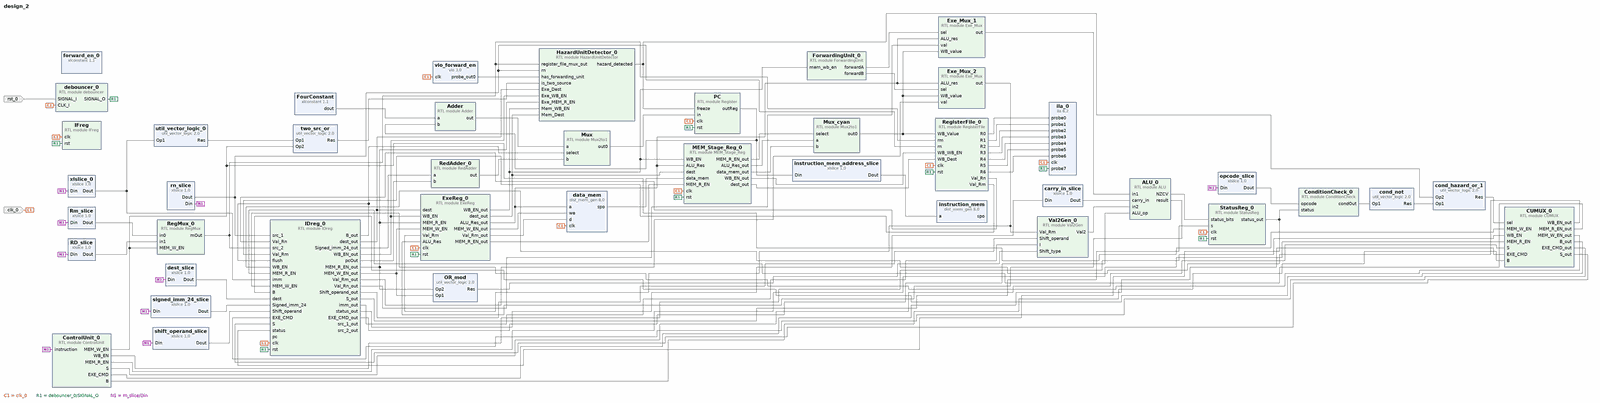
[diagram p0: block diagram of the top level, whole]
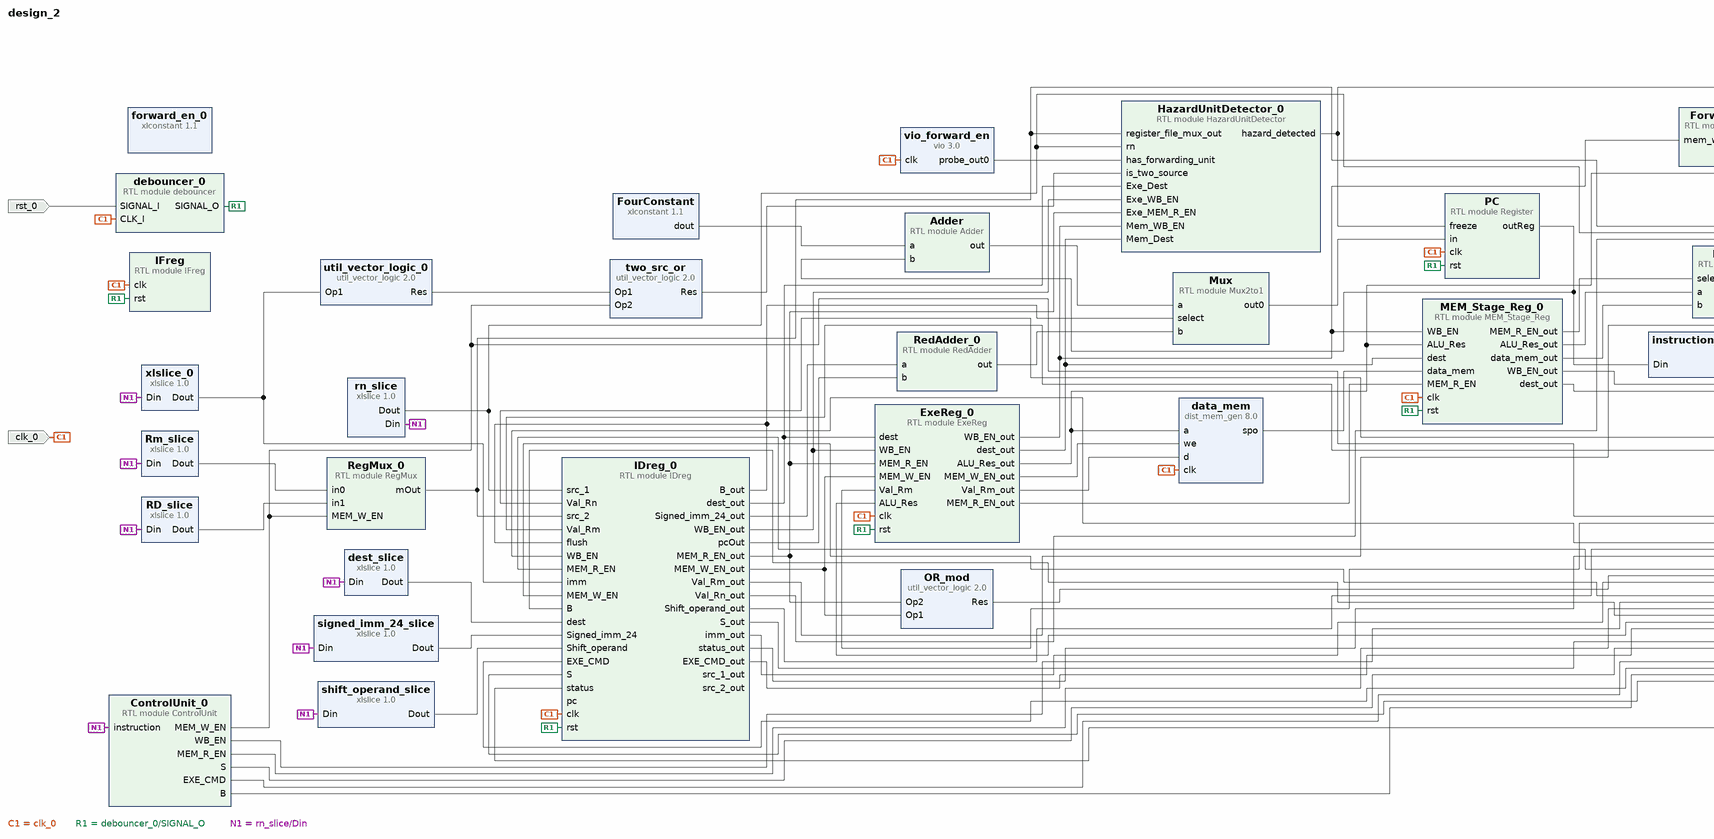
[diagram p1: block diagram of the top level, left part]
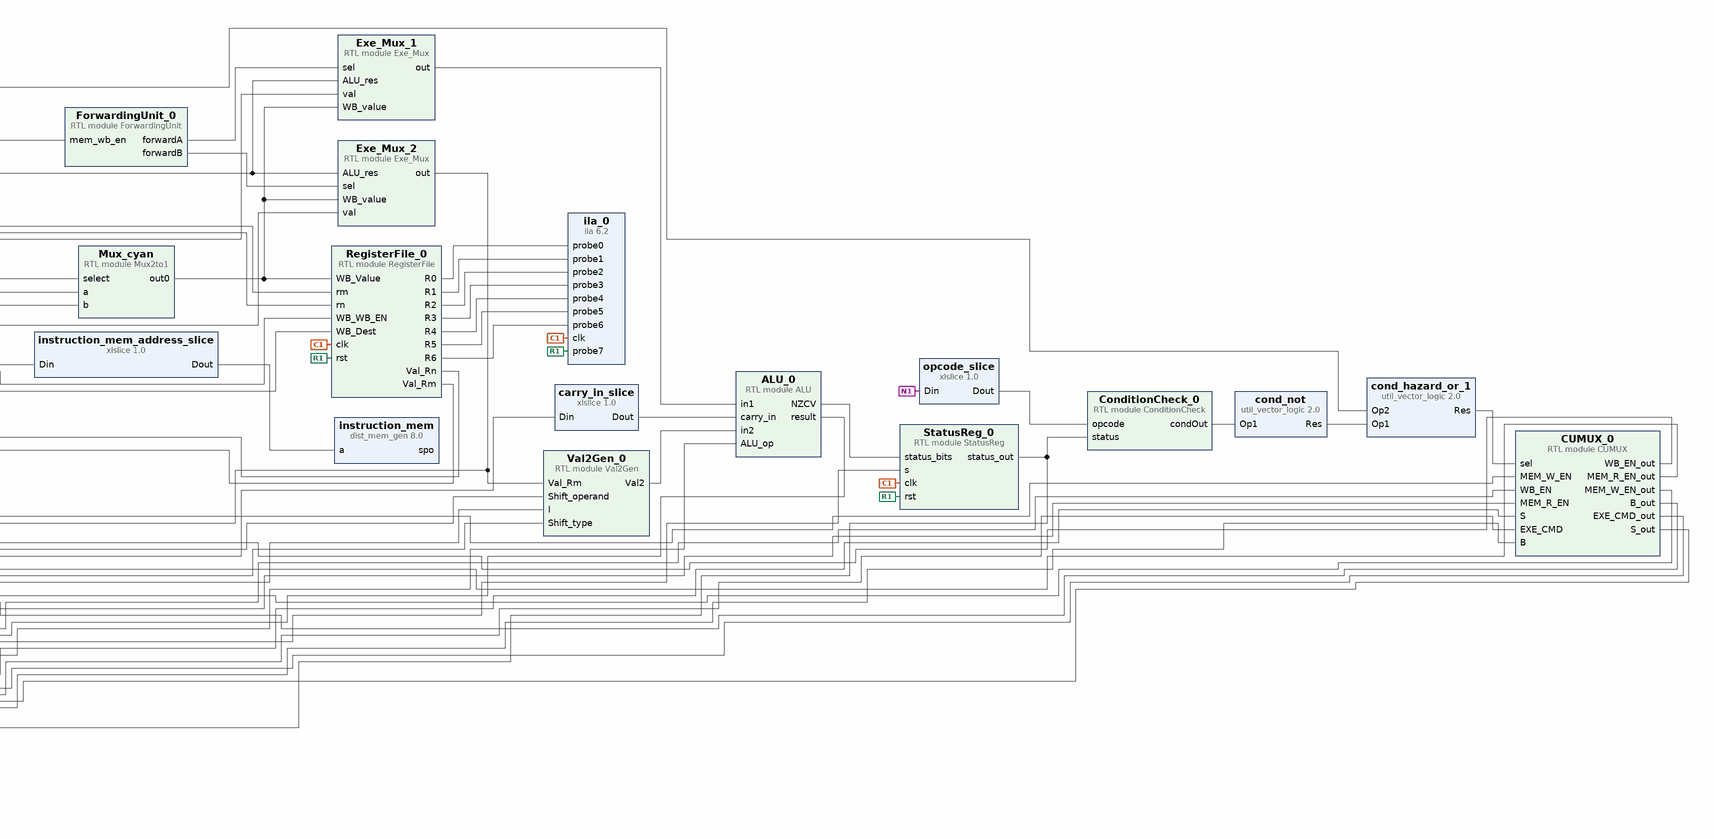
[diagram p2: block diagram of the top level, right part]
# Vivado block design design_2, xc7z010clg400-1, Vivado 2018.3
create_bd_design design_2

create_bd_port -dir I -type clk clk_0
create_bd_port -dir I -type rst rst_0

create_bd_cell -type ip -vlnv xilinx.com:ip:xlconstant:1.1 FourConstant
set_property -dict {CONFIG.CONST_VAL 1 CONFIG.CONST_WIDTH 32} [get_bd_cells FourConstant]
create_bd_cell -type module -reference Mux2to1 Mux
create_bd_cell -type module -reference Register PC
create_bd_cell -type module -reference debouncer debouncer_0
create_bd_cell -type ip -vlnv xilinx.com:ip:ila:6.2 ila_0
set_property -dict [list \
  CONFIG.C_ENABLE_ILA_AXI_MON false \
  CONFIG.C_MONITOR_TYPE Native \
  CONFIG.C_NUM_OF_PROBES 8 \
  CONFIG.C_PROBE0_TYPE 1 \
  CONFIG.C_PROBE0_WIDTH 32 \
  CONFIG.C_PROBE1_TYPE 1 \
  CONFIG.C_PROBE1_WIDTH 32 \
  CONFIG.C_PROBE2_TYPE 1 \
  CONFIG.C_PROBE2_WIDTH 32 \
  CONFIG.C_PROBE3_TYPE 1 \
  CONFIG.C_PROBE3_WIDTH 32 \
  CONFIG.C_PROBE4_TYPE 1 \
  CONFIG.C_PROBE4_WIDTH 32 \
  CONFIG.C_PROBE5_TYPE 1 \
  CONFIG.C_PROBE5_WIDTH 32 \
  CONFIG.C_PROBE6_TYPE 1 \
  CONFIG.C_PROBE6_WIDTH 32 \
  CONFIG.C_PROBE7_TYPE 2 \
  CONFIG.C_PROBE7_WIDTH 1 \
] [get_bd_cells ila_0]
create_bd_cell -type ip -vlnv xilinx.com:ip:xlslice:1.0 instruction_mem_address_slice
set_property -dict {CONFIG.DIN_FROM 12 CONFIG.DOUT_WIDTH 13} [get_bd_cells instruction_mem_address_slice]
create_bd_cell -type module -reference RegMux RegMux_0
create_bd_cell -type ip -vlnv xilinx.com:ip:xlslice:1.0 rn_slice
set_property -dict {CONFIG.DIN_FROM 19 CONFIG.DIN_TO 16 CONFIG.DOUT_WIDTH 4} [get_bd_cells rn_slice]
create_bd_cell -type ip -vlnv xilinx.com:ip:xlslice:1.0 RD_slice
set_property -dict {CONFIG.DIN_FROM 15 CONFIG.DIN_TO 12 CONFIG.DOUT_WIDTH 4} [get_bd_cells RD_slice]
create_bd_cell -type ip -vlnv xilinx.com:ip:xlslice:1.0 Rm_slice
set_property -dict {CONFIG.DIN_FROM 3 CONFIG.DOUT_WIDTH 4} [get_bd_cells Rm_slice]
create_bd_cell -type ip -vlnv xilinx.com:ip:xlslice:1.0 opcode_slice
set_property -dict {CONFIG.DIN_FROM 31 CONFIG.DIN_TO 28 CONFIG.DOUT_WIDTH 4} [get_bd_cells opcode_slice]
create_bd_cell -type ip -vlnv xilinx.com:ip:util_vector_logic:2.0 cond_not
set_property -dict {CONFIG.C_OPERATION not CONFIG.C_SIZE 1} [get_bd_cells cond_not]
create_bd_cell -type ip -vlnv xilinx.com:ip:util_vector_logic:2.0 cond_hazard_or_1
set_property -dict {CONFIG.C_OPERATION or CONFIG.C_SIZE 1} [get_bd_cells cond_hazard_or_1]
create_bd_cell -type ip -vlnv xilinx.com:ip:xlslice:1.0 dest_slice
set_property -dict {CONFIG.DIN_FROM 15 CONFIG.DIN_TO 12 CONFIG.DOUT_WIDTH 4} [get_bd_cells dest_slice]
create_bd_cell -type ip -vlnv xilinx.com:ip:xlslice:1.0 signed_imm_24_slice
set_property -dict {CONFIG.DIN_FROM 23 CONFIG.DIN_TO 0 CONFIG.DOUT_WIDTH 24} [get_bd_cells signed_imm_24_slice]
create_bd_cell -type ip -vlnv xilinx.com:ip:xlslice:1.0 shift_operand_slice
set_property -dict {CONFIG.DIN_FROM 11 CONFIG.DOUT_WIDTH 12} [get_bd_cells shift_operand_slice]
create_bd_cell -type ip -vlnv xilinx.com:ip:dist_mem_gen:8.0 instruction_mem
set_property -dict [list \
  CONFIG.coefficient_file output.coe \
  CONFIG.data_width 32 \
  CONFIG.depth 8192 \
  CONFIG.memory_type rom \
] [get_bd_cells instruction_mem]
create_bd_cell -type ip -vlnv xilinx.com:ip:dist_mem_gen:8.0 data_mem
set_property -dict {CONFIG.data_width 32 CONFIG.depth 8192} [get_bd_cells data_mem]
create_bd_cell -type ip -vlnv xilinx.com:ip:util_vector_logic:2.0 OR_mod
set_property -dict {CONFIG.C_OPERATION or} [get_bd_cells OR_mod]
create_bd_cell -type ip -vlnv xilinx.com:ip:xlslice:1.0 carry_in_slice
set_property -dict {CONFIG.DIN_FROM 1 CONFIG.DIN_TO 1 CONFIG.DIN_WIDTH 4 CONFIG.DOUT_WIDTH 1} [get_bd_cells carry_in_slice]
create_bd_cell -type module -reference ExeReg ExeReg_0
create_bd_cell -type module -reference Mux2to1 Mux_cyan
create_bd_cell -type module -reference MEM_Stage_Reg MEM_Stage_Reg_0
create_bd_cell -type module -reference Val2Gen Val2Gen_0
create_bd_cell -type ip -vlnv xilinx.com:ip:util_vector_logic:2.0 two_src_or
set_property -dict {CONFIG.C_OPERATION or CONFIG.C_SIZE 1} [get_bd_cells two_src_or]
create_bd_cell -type ip -vlnv xilinx.com:ip:util_vector_logic:2.0 util_vector_logic_0
set_property -dict {CONFIG.C_OPERATION not CONFIG.C_SIZE 1} [get_bd_cells util_vector_logic_0]
create_bd_cell -type module -reference CUMUX CUMUX_0
create_bd_cell -type module -reference ConditionCheck ConditionCheck_0
create_bd_cell -type module -reference StatusReg StatusReg_0
create_bd_cell -type module -reference Adder Adder
create_bd_cell -type module -reference RedAdder RedAdder_0
create_bd_cell -type ip -vlnv xilinx.com:ip:xlslice:1.0 xlslice_0
set_property -dict {CONFIG.DIN_FROM 25 CONFIG.DIN_TO 25} [get_bd_cells xlslice_0]
create_bd_cell -type module -reference IDreg IDreg_0
create_bd_cell -type module -reference Exe_Mux Exe_Mux_1
create_bd_cell -type module -reference Exe_Mux Exe_Mux_2
create_bd_cell -type module -reference RegisterFile RegisterFile_0
create_bd_cell -type ip -vlnv xilinx.com:ip:vio:3.0 vio_forward_en
set_property -dict {CONFIG.C_NUM_PROBE_IN 0} [get_bd_cells vio_forward_en]
create_bd_cell -type ip -vlnv xilinx.com:ip:xlconstant:1.1 forward_en_0
set_property -dict {CONFIG.CONST_VAL 1} [get_bd_cells forward_en_0]
create_bd_cell -type module -reference IFreg IFreg
create_bd_cell -type module -reference ForwardingUnit ForwardingUnit_0
create_bd_cell -type module -reference HazardUnitDetector HazardUnitDetector_0
create_bd_cell -type module -reference ControlUnit ControlUnit_0
create_bd_cell -type module -reference ALU ALU_0

# ---- connections ----

connect_bd_net -net Adder_0_out [get_bd_pins Adder/out] [get_bd_pins Mux/a]
connect_bd_net -net Freeze_dout [get_bd_pins HazardUnitDetector_0/hazard_detected] [get_bd_pins PC/freeze] [get_bd_pins cond_hazard_or_1/Op2]
connect_bd_net -net Mux2to1_0_out [get_bd_pins Mux/out0] [get_bd_pins PC/in]
connect_bd_net -net PC_out [get_bd_pins PC/outReg] [get_bd_pins instruction_mem_address_slice/Din] [get_bd_pins Adder/b]
connect_bd_net -net clk_0_1 [get_bd_ports clk_0] \
  [get_bd_pins PC/clk] [get_bd_pins ila_0/clk] [get_bd_pins debouncer_0/CLK_I] [get_bd_pins ExeReg_0/clk] \
  [get_bd_pins data_mem/clk] [get_bd_pins MEM_Stage_Reg_0/clk] [get_bd_pins StatusReg_0/clk] [get_bd_pins IDreg_0/clk] \
  [get_bd_pins RegisterFile_0/clk] [get_bd_pins vio_forward_en/clk] [get_bd_pins IFreg/clk]
connect_bd_net [get_bd_pins debouncer_0/SIGNAL_O] \
  [get_bd_pins PC/rst] [get_bd_pins ExeReg_0/rst] [get_bd_pins MEM_Stage_Reg_0/rst] [get_bd_pins StatusReg_0/rst] \
  [get_bd_pins IDreg_0/rst] [get_bd_pins RegisterFile_0/rst] [get_bd_pins ila_0/probe7] [get_bd_pins IFreg/rst]
connect_bd_net -net flush_dout [get_bd_pins IDreg_0/B_out] [get_bd_pins Mux/select] [get_bd_pins IDreg_0/flush]
connect_bd_net -net xlconstant_0_dout [get_bd_pins FourConstant/dout] [get_bd_pins Adder/a]
connect_bd_net -net xlslice_0_Dout [get_bd_pins instruction_mem_address_slice/Dout] [get_bd_pins instruction_mem/a]
connect_bd_net [get_bd_pins RegMux_0/mOut] \
  [get_bd_pins IDreg_0/src_2] [get_bd_pins RegisterFile_0/rm] [get_bd_pins HazardUnitDetector_0/register_file_mux_out]
connect_bd_net -net xlslice_1_Dout [get_bd_pins rn_slice/Dout] \
  [get_bd_pins IDreg_0/src_1] [get_bd_pins RegisterFile_0/rn] [get_bd_pins HazardUnitDetector_0/rn]
connect_bd_net [get_bd_pins ControlUnit_0/MEM_W_EN] [get_bd_pins RegMux_0/MEM_W_EN] [get_bd_pins CUMUX_0/MEM_W_EN] [get_bd_pins two_src_or/Op2]
connect_bd_net [get_bd_pins Rm_slice/Dout] [get_bd_pins RegMux_0/in0]
connect_bd_net [get_bd_pins RD_slice/Dout] [get_bd_pins RegMux_0/in1]
connect_bd_net [get_bd_pins opcode_slice/Dout] [get_bd_pins ConditionCheck_0/opcode]
connect_bd_net [get_bd_pins ConditionCheck_0/condOut] [get_bd_pins cond_not/Op1]
connect_bd_net -net util_vector_logic_0_Res [get_bd_pins cond_not/Res] [get_bd_pins cond_hazard_or_1/Op1]
connect_bd_net [get_bd_pins cond_hazard_or_1/Res] [get_bd_pins CUMUX_0/sel]
connect_bd_net [get_bd_pins ControlUnit_0/WB_EN] [get_bd_pins CUMUX_0/WB_EN]
connect_bd_net [get_bd_pins ControlUnit_0/MEM_R_EN] [get_bd_pins CUMUX_0/MEM_R_EN]
connect_bd_net [get_bd_pins ControlUnit_0/S] [get_bd_pins CUMUX_0/S]
connect_bd_net [get_bd_pins ControlUnit_0/EXE_CMD] [get_bd_pins CUMUX_0/EXE_CMD]
connect_bd_net [get_bd_pins ControlUnit_0/B] [get_bd_pins CUMUX_0/B]
connect_bd_net [get_bd_pins RegisterFile_0/Val_Rn] [get_bd_pins IDreg_0/Val_Rn]
connect_bd_net [get_bd_pins RegisterFile_0/Val_Rm] [get_bd_pins IDreg_0/Val_Rm]
connect_bd_net [get_bd_pins CUMUX_0/WB_EN_out] [get_bd_pins IDreg_0/WB_EN]
connect_bd_net [get_bd_pins CUMUX_0/MEM_R_EN_out] [get_bd_pins IDreg_0/MEM_R_EN]
connect_bd_net [get_bd_pins CUMUX_0/MEM_W_EN_out] [get_bd_pins IDreg_0/MEM_W_EN]
connect_bd_net [get_bd_pins CUMUX_0/B_out] [get_bd_pins IDreg_0/B]
connect_bd_net [get_bd_pins CUMUX_0/EXE_CMD_out] [get_bd_pins IDreg_0/EXE_CMD]
connect_bd_net [get_bd_pins CUMUX_0/S_out] [get_bd_pins IDreg_0/S]
connect_bd_net [get_bd_pins StatusReg_0/status_out] [get_bd_pins ConditionCheck_0/status] [get_bd_pins IDreg_0/status]
connect_bd_net [get_bd_pins dest_slice/Dout] [get_bd_pins IDreg_0/dest]
connect_bd_net [get_bd_pins signed_imm_24_slice/Dout] [get_bd_pins IDreg_0/Signed_imm_24]
connect_bd_net [get_bd_pins shift_operand_slice/Dout] [get_bd_pins IDreg_0/Shift_operand]
connect_bd_net -net IFreg_instructionOut [get_bd_pins rn_slice/Din] \
  [get_bd_pins Rm_slice/Din] [get_bd_pins RD_slice/Din] [get_bd_pins opcode_slice/Din] [get_bd_pins dest_slice/Din] \
  [get_bd_pins signed_imm_24_slice/Din] [get_bd_pins shift_operand_slice/Din] [get_bd_pins xlslice_0/Din] \
  [get_bd_pins ControlUnit_0/instruction]
connect_bd_net [get_bd_pins IDreg_0/S_out] [get_bd_pins StatusReg_0/s]
# net dist_mem_gen_0_spo has one end: instruction_mem/spo
connect_bd_net [get_bd_pins IDreg_0/Val_Rm_out] [get_bd_pins Exe_Mux_2/val]
connect_bd_net [get_bd_pins IDreg_0/Shift_operand_out] [get_bd_pins Val2Gen_0/Shift_operand]
connect_bd_net [get_bd_pins Val2Gen_0/Val2] [get_bd_pins ALU_0/in2]
connect_bd_net [get_bd_pins IDreg_0/imm_out] [get_bd_pins Val2Gen_0/I]
connect_bd_net [get_bd_pins IDreg_0/Val_Rn_out] [get_bd_pins Exe_Mux_1/val]
connect_bd_net [get_bd_pins IDreg_0/EXE_CMD_out] [get_bd_pins ALU_0/ALU_op]
connect_bd_net [get_bd_pins IDreg_0/MEM_R_EN_out] \
  [get_bd_pins OR_mod/Op2] [get_bd_pins ExeReg_0/MEM_R_EN] [get_bd_pins HazardUnitDetector_0/Exe_MEM_R_EN]
connect_bd_net [get_bd_pins IDreg_0/MEM_W_EN_out] [get_bd_pins OR_mod/Op1] [get_bd_pins ExeReg_0/MEM_W_EN]
connect_bd_net [get_bd_pins OR_mod/Res] [get_bd_pins Val2Gen_0/Shift_type]
connect_bd_net [get_bd_pins IDreg_0/status_out] [get_bd_pins carry_in_slice/Din]
connect_bd_net [get_bd_pins carry_in_slice/Dout] [get_bd_pins ALU_0/carry_in]
connect_bd_net [get_bd_pins ALU_0/NZCV] [get_bd_pins StatusReg_0/status_bits]
connect_bd_net [get_bd_pins IDreg_0/dest_out] [get_bd_pins ExeReg_0/dest] [get_bd_pins HazardUnitDetector_0/Exe_Dest]
connect_bd_net [get_bd_pins IDreg_0/WB_EN_out] [get_bd_pins ExeReg_0/WB_EN] [get_bd_pins HazardUnitDetector_0/Exe_WB_EN]
connect_bd_net [get_bd_pins ALU_0/result] [get_bd_pins ExeReg_0/ALU_Res]
connect_bd_net [get_bd_pins ExeReg_0/MEM_W_EN_out] [get_bd_pins data_mem/we]
connect_bd_net [get_bd_pins ExeReg_0/ALU_Res_out] \
  [get_bd_pins data_mem/a] [get_bd_pins MEM_Stage_Reg_0/ALU_Res] [get_bd_pins Exe_Mux_2/ALU_res] \
  [get_bd_pins Exe_Mux_1/ALU_res]
connect_bd_net [get_bd_pins ExeReg_0/Val_Rm_out] [get_bd_pins data_mem/d]
connect_bd_net [get_bd_pins data_mem/spo] [get_bd_pins MEM_Stage_Reg_0/data_mem]
connect_bd_net [get_bd_pins ExeReg_0/dest_out] [get_bd_pins MEM_Stage_Reg_0/dest] [get_bd_pins HazardUnitDetector_0/Mem_Dest]
connect_bd_net [get_bd_pins ExeReg_0/WB_EN_out] \
  [get_bd_pins MEM_Stage_Reg_0/WB_EN] [get_bd_pins ForwardingUnit_0/mem_wb_en] [get_bd_pins HazardUnitDetector_0/Mem_WB_EN]
connect_bd_net [get_bd_pins ExeReg_0/MEM_R_EN_out] [get_bd_pins MEM_Stage_Reg_0/MEM_R_EN]
connect_bd_net [get_bd_pins MEM_Stage_Reg_0/MEM_R_EN_out] [get_bd_pins Mux_cyan/select]
connect_bd_net [get_bd_pins MEM_Stage_Reg_0/ALU_Res_out] [get_bd_pins Mux_cyan/a]
connect_bd_net [get_bd_pins MEM_Stage_Reg_0/data_mem_out] [get_bd_pins Mux_cyan/b]
connect_bd_net [get_bd_pins MEM_Stage_Reg_0/WB_EN_out] [get_bd_pins RegisterFile_0/WB_WB_EN]
connect_bd_net [get_bd_pins Mux_cyan/out0] [get_bd_pins Exe_Mux_1/WB_value] [get_bd_pins Exe_Mux_2/WB_value] [get_bd_pins RegisterFile_0/WB_Value]
connect_bd_net [get_bd_pins MEM_Stage_Reg_0/dest_out] [get_bd_pins RegisterFile_0/WB_Dest]
connect_bd_net [get_bd_pins two_src_or/Res] [get_bd_pins HazardUnitDetector_0/is_two_source]
connect_bd_net [get_bd_pins util_vector_logic_0/Res] [get_bd_pins two_src_or/Op1]
# net IFreg_pcOut has one end: IDreg_0/pc
connect_bd_net [get_bd_pins IDreg_0/Signed_imm_24_out] [get_bd_pins RedAdder_0/a]
connect_bd_net [get_bd_pins IDreg_0/pcOut] [get_bd_pins RedAdder_0/b]
connect_bd_net [get_bd_pins RedAdder_0/out] [get_bd_pins Mux/b]
connect_bd_net [get_bd_pins xlslice_0/Dout] [get_bd_pins util_vector_logic_0/Op1] [get_bd_pins IDreg_0/imm]
# net IDreg_0_src_1_out has one end: IDreg_0/src_1_out
# net IDreg_0_src_2_out has one end: IDreg_0/src_2_out
connect_bd_net [get_bd_pins ForwardingUnit_0/forwardA] [get_bd_pins Exe_Mux_1/sel]
connect_bd_net [get_bd_pins ForwardingUnit_0/forwardB] [get_bd_pins Exe_Mux_2/sel]
connect_bd_net [get_bd_pins Exe_Mux_1/out] [get_bd_pins ALU_0/in1]
connect_bd_net [get_bd_pins Exe_Mux_2/out] [get_bd_pins Val2Gen_0/Val_Rm] [get_bd_pins ExeReg_0/Val_Rm]
connect_bd_net [get_bd_pins RegisterFile_0/R0] [get_bd_pins ila_0/probe0]
connect_bd_net [get_bd_pins RegisterFile_0/R1] [get_bd_pins ila_0/probe1]
connect_bd_net [get_bd_pins RegisterFile_0/R2] [get_bd_pins ila_0/probe2]
connect_bd_net [get_bd_pins RegisterFile_0/R3] [get_bd_pins ila_0/probe3]
connect_bd_net [get_bd_pins RegisterFile_0/R4] [get_bd_pins ila_0/probe4]
connect_bd_net [get_bd_pins RegisterFile_0/R5] [get_bd_pins ila_0/probe5]
connect_bd_net [get_bd_pins RegisterFile_0/R6] [get_bd_pins ila_0/probe6]
connect_bd_net [get_bd_pins vio_forward_en/probe_out0] [get_bd_pins HazardUnitDetector_0/has_forwarding_unit]
connect_bd_net -net rst_0_1 [get_bd_ports rst_0] [get_bd_pins debouncer_0/SIGNAL_I]

validate_bd_design
save_bd_design
